# Altium schematic sheet DebugUSB.SchDoc
size A3; SheetNumber: 6; SheetTotal: 10
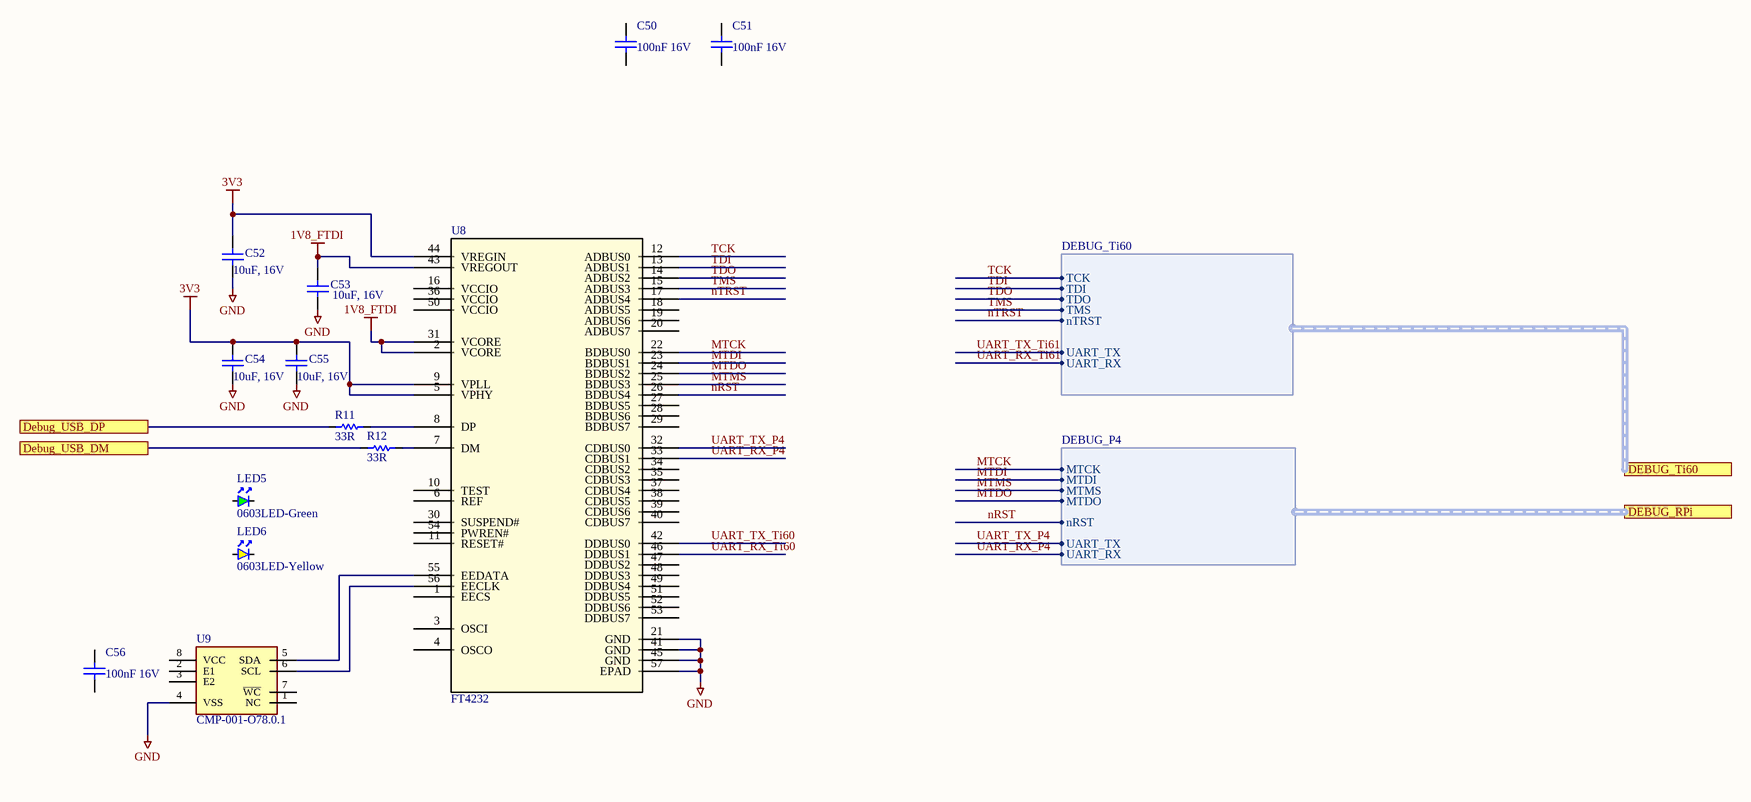
[diagram p0: DebugUSB.SchDoc]

## Parts
C50  100nF 16V  [0402]
C51  100nF 16V  [0402]
C52  10uF, 16V  [0603 Capacitor]
C53  10uF, 16V  [0603 Capacitor]
C54  10uF, 16V  [0603 Capacitor]
C55  10uF, 16V  [0603 Capacitor]
C56  100nF 16V  [0402]
LED5  0603LED-Green  [LED-0603-RED]
LED6  0603LED-Yellow  [LED-0603-RED]
R11  33R  [0603 Resistor]
R12  33R  [0603 Resistor]
U8  FT4232  [VQFN-56Y856_FTD-M]
U9  CMP-001-O78.0.1  [M24C04-DRMN3TP_K-Footprint-1]

## Ports
DEBUG_RPi (harness DEBUG_P4), DEBUG_Ti60 (harness DEBUG_Ti60), Debug_USB_DM, Debug_USB_DP

## Harnesses
DEBUG_Ti60: TCK, TDI, TDO, TMS, nTRST, UART_TX, UART_RX
DEBUG_P4: MTCK, MTDI, nRST, UART_TX, UART_RX, MTMS, MTDO

## Nets
1V8_FTDI: C53.2 U8.2(VCORE) U8.31(VCORE) U8.43(VREGOUT)
3V3: C52.2 C54.2 C55.2 U8.5(VPHY) U8.9(VPLL) U8.44(VREGIN)
GND: C52.1 C53.1 C54.1 C55.1 U8.21(GND) U8.41(GND) U8.45(GND) U8.57(EPAD) U9.4(VSS)
Debug_USB_DM: R12.1 ; port Debug_USB_DM
Debug_USB_DP: R11.1 ; port Debug_USB_DP
MTCK: U8.22(BDBUS0) ; port DEBUG_RPi.MTCK
MTDI: U8.23(BDBUS1) ; port DEBUG_RPi.MTDI
MTDO: U8.24(BDBUS2) ; port DEBUG_RPi.MTDO
MTMS: U8.25(BDBUS3) ; port DEBUG_RPi.MTMS
nRST: U8.26(BDBUS4) ; port DEBUG_RPi.nRST
nTRST: U8.17(ADBUS4) ; port DEBUG_Ti60.nTRST
TCK: U8.12(ADBUS0) ; port DEBUG_Ti60.TCK
TDI: U8.13(ADBUS1) ; port DEBUG_Ti60.TDI
TDO: U8.14(ADBUS2) ; port DEBUG_Ti60.TDO
TMS: U8.15(ADBUS3) ; port DEBUG_Ti60.TMS
UART_RX_P4: U8.33(CDBUS1) ; port DEBUG_RPi.UART_RX
UART_RX_Ti60: U8.46(DDBUS1)
UART_RX_Ti61: port DEBUG_Ti60.UART_RX
UART_TX_P4: U8.32(CDBUS0) ; port DEBUG_RPi.UART_TX
UART_TX_Ti60: U8.42(DDBUS0)
UART_TX_Ti61: port DEBUG_Ti60.UART_TX
NetR11_2: R11.2 U8.8(DP)
NetR12_2: R12.2 U8.7(DM)
NetU8_55: U8.55(EEDATA) U9.5(SDA)
NetU8_56: U8.56(EECLK) U9.6(SCL)

Not connected (* = marked no-connect by the designer): C50 1 2; C51 1 2; C56 1 2; LED5 1(A) 2(K); LED6 1(A) 2(K); U8 1(EECS) 3(OSCI) 4(OSCO) 6(REF) 10(TEST) 11(RESET#) 16(VCCIO) 18(ADBUS5) 19(ADBUS6) 20(ADBUS7) 27(BDBUS5) 28(BDBUS6) 29(BDBUS7) 30(SUSPEND#) 34(CDBUS2) 35(CDBUS3) 36(VCCIO) 37(CDBUS4) 38(CDBUS5) 39(CDBUS6) 40(CDBUS7) 47(DDBUS2) 48(DDBUS3) 49(DDBUS4) 50(VCCIO) 51(DDBUS5) 52(DDBUS6) 53(DDBUS7) 54(PWREN#); U9 1(NC) 2(E1) 3(E2) 7(~{WC}) 8(VCC)

## Notes on the sheet
- Project:
- Title:
- Sheet number:
- Revision:
- Designer:
- out of
- Date:

## Library data of the parts
C50 C51 C56 = CMP-00017-A.2
C52-C55 = CMP-001-B36-7: 10uF, 16V, 20%, X5R, 0603; value: 10uF
LED5 = CMP-001-C10-9: SMD LED 0603, Green
LED6 = CMP-001-I07-1: SMD LED 0603, Yellow
R11 R12 = CMP-001-C30-7: 33R, 1%, 1/10W, 0603; Manufacturer: Panasonic; Manufacturer Part Number: ERJ-3EKF33R0V; Temperature Coefficient: 100ppm/°C; Max Power Dissipation: 100mW; Voltage Rating: 75V; REACH SVHC: No SVHC; Resistance: 33R; Composition: Thick Film; Tolerance: 1%; Lead Free: Lead Free; Contact Plating: Tin; Package Quantity: 1; Number of Terminations: 2; Number of Pins: 2; Case Code (Metric): 1608; Width: 0.031inch; Min Operating Temperature: -55°C; Military Standard: Not; Termination: SMD/SMT; Radiation Hardening: No; Case Code (Imperial): 0603; Mount: Surface Mount; Depth: 0.8mm; Max Operating Temperature: 155°C; Voltage Rating (DC): 75V; Features: Automotive AEC-Q200; Power Rating: 100mW; Packaging: Tape and Reel; Supplier Part Number: P33.0HCT-ND; Length: 1.6mm; Supplier: Digi-Key; Height: 0.022inch; Case/Package: 0603
U8 = CMP-001-0004-2: Usb Hi-speed to Quad Channel Serial UART/JTAG/SPI/I2C IC, QFN-56; Data Rate: 1.5Mbps; Max Supply Voltage: 1.98V; Number of I/Os: 4; Interface: I2C, RS-232, RS-422, RS-485, SPI, UART, USB; Clock Frequency: 12MHz; Min Supply Voltage: 1.62V; Operating Supply Voltage: 1.8V; Width: 8mm; RoHS: Compliant; Length: 8mm; Number of Terminals: 56; Height - Seated (Max): 1mm; Packaging: Cut Tape; REACH SVHC: Yes; Min Operating Temperature: -40°C; Case/Package: VQFN; Terminal Pitch: 500µm; Pins: 64; Lifecycle Status: Production; Max Operating Temperature: 85°C
U9 = CMP-031-000000-1: IC EEPROM 4KBIT I2C 1MHZ 8SOIC; Manufacturer Part Number: M24C04-DRMN3TP/K; Manufacturer: STMicroelectronics; Source: Components - 10.10.25 - 00.26.2.SchLib; Pin Count: 8; Design Item ID: CMP-001-O78.0.1; Component Type: EEPROM